# EAGLE design tsr (EAGLE 5.07)
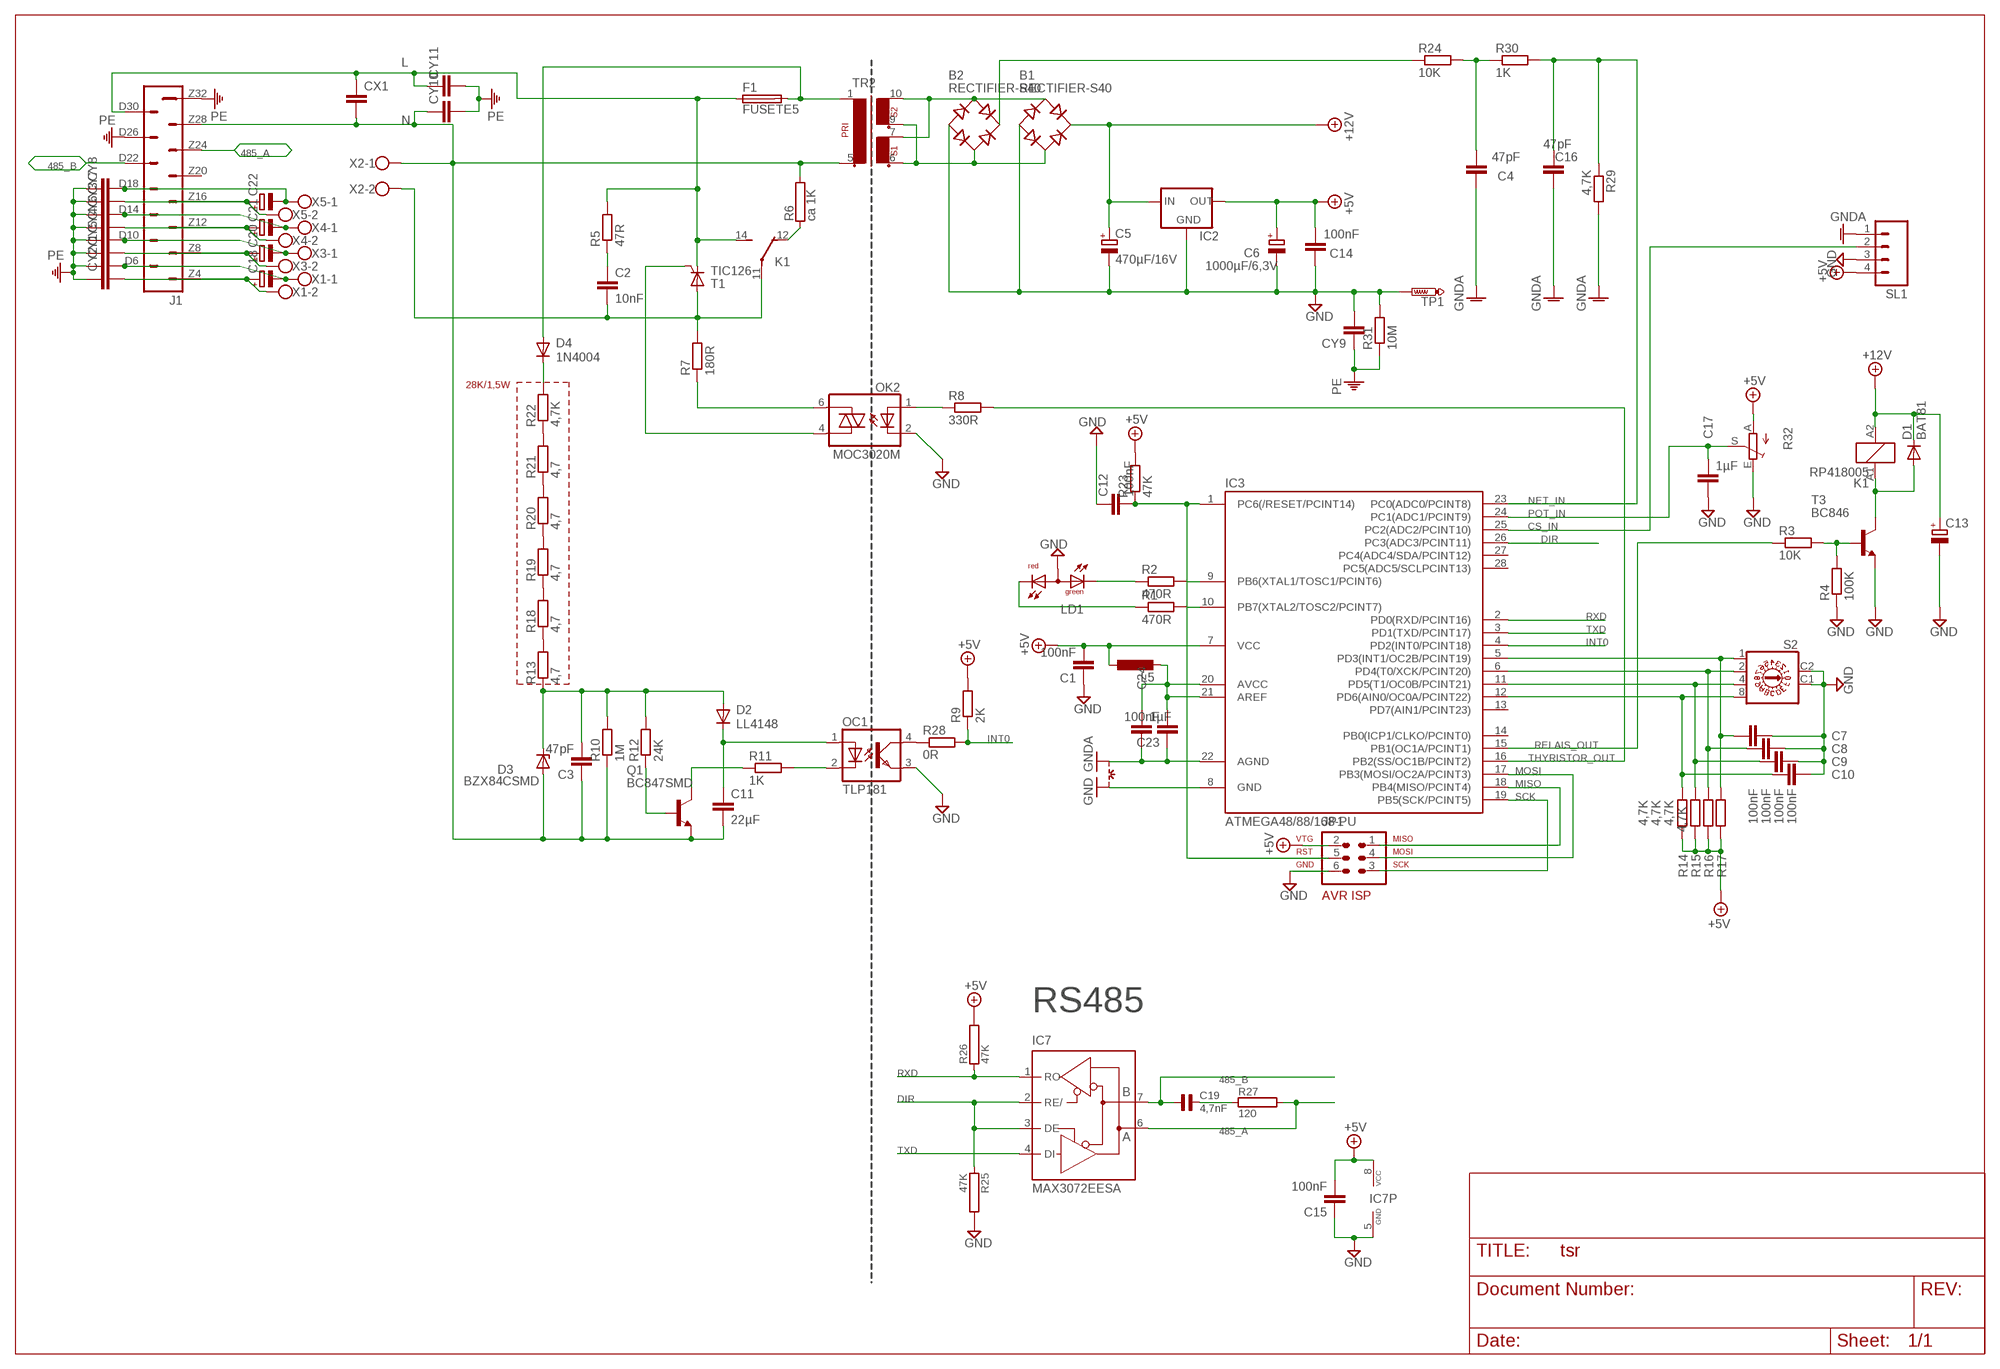
[diagram p0: schematic, sheet 1]

## Parts
B1  RECTIFIER-S40  [TO-269AA]
B2  RECTIFIER-S40  [TO-269AA]
C1  100nF  C-EU025-025X050  [C025-025X050]
C2  10nF  C-EU075-042X103  [C075-042X103]
C3  47pF  C-EUC0805  [C0805]
C4  47pF  C-EUC0805  [C0805]
C5  470µF/16V  CPOL-EUE3.5-8  [E3,5-8]
C6  1000µF/6,3V  CPOL-EUE2.5-7  [E2,5-7]
C7  100nF  C-EUC0805  [C0805]
C8  100nF  C-EUC0805  [C0805]
C9  100nF  C-EUC0805  [C0805]
C10  100nF  C-EUC0805  [C0805]
C11  22µF  C-EUC1206  [C1206]
C12  100nF  C-EUC0805  [C0805]
C13  CPOL-EUE3.5-8  [E3,5-8]
C14  100nF  C-EUC0805  [C0805]
C15  100nF  C-EU025-025X050  [C025-025X050]
C16  47pF  C-EUC0805  [C0805]
C17  1µF  C-EUC0805  [C0805]
C18  CPOL-EUE5-13  [E5-13]
C19  4,7nF  C0805  [C0805]
C20  CPOL-EUE5-13  [E5-13]
C21  CPOL-EUE5-13  [E5-13]
C22  CPOL-EUE5-13  [E5-13]
C23  100nF  C-EUC0805  [C0805]
C24  1µF  C-EUC0805  [C0805]
CX1  CXXC10B5  [XC10B5]
CY1  CYYC10B4  [YC10B4]
CY2  CYYC10B4  [YC10B4]
CY3  CYYC10B4  [YC10B4]
CY4  CYYC10B4  [YC10B4]
CY5  CYYC10B4  [YC10B4]
CY6  CYYC10B4  [YC10B4]
CY7  CYYC10B4  [YC10B4]
CY8  CYYC10B4  [YC10B4]
CY9  CYYC7B5  [YC7B5]
CY10  CYYC10B4  [YC10B4]
CY11  CYYC10B4  [YC10B4]
D1  BAT81  [DO34-7]
D2  LL4148  [MINIMELF]
D3  BZX84CSMD  [TO236]
D4  1N4004  [DO41-10]
F1  FUSETE5  [TE5]
IC2  78XXS  [78XXS]
IC3  ATMEGA48/88/168-PU  [DIL28-3]
IC7  MAX3072EESA  MAX481CSA  [SO08]
J1  H15MLH15ML  [H15ML]
JP1  AVR-ISP-6  [AVR-ISP-6]
K1  RP418005  [RT-C/O12A3.5]
L5  L-EUL2825P  [L2825P]
LD1  DUOLED-RG-A  [DUOLED-A-5MM]
OC1  TLP181  [SO-4]
OK2  MOC3020M  [DIL06]
Q1  BC847SMD  [SOT23]
R1  470R  R-EU_R0805  [R0805]
R2  470R  R-EU_R0805  [R0805]
R3  10K  R-EU_R0805  [R0805]
R4  100K  R-EU_R0805  [R0805]
R5  47R  R-EU_0309/10  [0309/10]
R6  ca 1K  RKH208-8R  [KH208R-8]
R7  180R  R-EU_0207/10  [0207/10@1]
R8  330R  R-EU_R0805  [R0805]
R9  2K  R-EU_R0805  [R0805]
R10  1M  R-EU_R0805  [R0805]
R11  1K  R-EU_R0805  [R0805]
R12  24K  R-EU_R0805  [R0805]
R13  4,7  R-EU_R1206  [R1206]
R14  4,7K  R-EU_R0805  [R0805]
R15  4,7K  R-EU_R0805  [R0805]
R16  4,7K  R-EU_R0805  [R0805]
R17  4,7K  R-EU_R0805  [R0805]
R18  4,7  R-EU_R1206  [R1206]
R19  4,7  R-EU_R1206  [R1206]
R20  4,7  R-EU_R1206  [R1206]
R21  4,7  R-EU_R1206  [R1206]
R22  4,7K  R-EU_R1206  [R1206]
R23  47K  R-EU_R0805  [R0805]
R24  10K  R-EU_0207/15  [0207/15@1]
R25  47K  R0805  [R0805]
R26  47K  R0805  [R0805]
R27  120  R0805  [R0805]
R28  0R  R-EU_0207/10  [0207/10@1]
R29  4,7K  R-EU_R0805  [R0805]
R30  1K  R-EU_R0805  [R0805]
R31  10M  R-EU_0309/12  [0309/12]
R32  TRIM_EU-ECP10P  [ECP10P]
S2  COPAL_HEX  [COPAL_HEX]
SL1  M04  [04P]
T1  TIC126  [TO220CS]
T3  BC846  [SOT23]
TP1  PTR1PAD1-13  [P1-13]
TR2  EI30-2  [EI30-2]
X1  W237-02P  [W237-132]
X2  W237-2N  [W237-2N]
X3  W237-02P  [W237-132]
X4  W237-02P  [W237-132]
X5  W237-02P  [W237-132]
~NUDEV~1  GND-GNDA  [GND-GNDA]

## Nets
485_A: IC7.6(A) J1.Z24 R27.2
485_B: C19.1 IC7.7(B) J1.D22
+5V: C1.2 C6.+ C14.2 C15.2 IC2.OUT IC3.7(VCC) IC7.8(VCC) JP1.2 L5.1 R9.2 R14.1 R15.1 R16.1 R17.1 R23.2 R26.2 R32.A SL1.4
+12V: B1.+ C5.+ C13.+ D1.C IC2.IN K1.A2
/RESET: C12.2 IC3.1(PC6(/RESET/PCINT14)) JP1.5 R23.1
CS_IN: IC3.25(PC2(ADC2/PCINT10)) SL1.2
DIR: IC3.26(PC3(ADC3/PCINT11)) IC7.2(RE/) IC7.3(DE) R25.1
E1: C7.2 IC3.5(PD3(INT1/OC2B/PCINT19)) R17.2 S2.1
E2: C8.2 IC3.6(PD4(T0/XCK/PCINT20)) R16.2 S2.2
E4: C9.2 IC3.11(PD5(T1/OC0B/PCINT21)) R15.2 S2.4
E8: C10.2 IC3.12(PD6(AIN0/OC0A/PCINT22)) R14.2 S2.8
GND: B1.- B2.- C1.1 C5.- C6.- C7.1 C8.1 C9.1 C10.1 C12.1 C13.- C14.1 C15.1 C17.2 CY9.2 IC2.GND IC3.8(GND) IC7.5(GND) JP1.6 LD1.A OC1.3(EMIT) OK2.2(C) R4.1 R25.2 R31.2 R32.E S2.C1 S2.C2 SL1.3 T3.2(E) TP1.TP ~NUDEV~1.GND
GNDA: C4.1 C16.1 C23.1 C24.2 IC3.22(AGND) R29.2 SL1.1 ~NUDEV~1.GNDA
INT0: IC3.4(PD2(INT0/PCINT18)) R9.1 R28.2
L: CX1.1 CY11.1 F1.1 J1.D30 K1.14(2:S) R5.2 T1.C
MISO: IC3.18(PB4(MISO/PCINT4)) JP1.1
MOSI: IC3.17(PB3(MOSI/OC2A/PCINT3)) JP1.4
N: C3.1 C11.2 CX1.2 CY10.1 D3.A J1.Z28 Q1.2(E) R6.2 R10.1 TR2.5 X2.1
N$1: C18.+ CY2.2 J1.Z4 X1.2
N$2: C20.+ CY5.2 J1.Z8 X3.2
N$3: C21.+ CY6.2 J1.Z12 X4.2
N$4: C22.+ CY7.2 J1.Z16 X5.2
N$5: R3.2 R4.2 T3.1(B)
N$6: D1.A K1.A1 T3.3(C)
N$7: K1.12(2:O) R6.1
N$8: C2.2 K1.11(2:P) R7.2 T1.A X2.2
N$9: C2.1 R5.1
N$10: OK2.4(A1) T1.G
N$11: OK2.6(A2) R7.1
N$12: OK2.1(A) R8.1
N$13: C18.- CY1.2 J1.D6 X1.1
N$14: C20.- CY4.2 J1.D10 X3.1
N$15: IC3.9(PB6(XTAL1/TOSC1/PCINT6)) R2.2
N$16: IC3.10(PB7(XTAL2/TOSC2/PCINT7)) R1.2
N$17: LD1.CX(CG) R2.1
N$18: LD1.CR R1.1
N$19: C21.- CY3.2 J1.D14 X4.1
N$21: C22.- CY8.2 J1.D18 X5.1
N$22: B1.AC2 B2.AC2 TR2.6 TR2.9
N$23: R13.2 R18.1
N$24: C3.2 D2.A D3.C R10.2 R12.2 R13.1
N$25: C11.1 D2.C OC1.1(A)
N$26: OC1.2(C) R11.2
N$27: Q1.3(C) R11.1
N$28: Q1.1(B) R12.1
N$29: R18.2 R19.1
N$31: R19.2 R20.1
N$32: R20.2 R21.1
N$33: D4.C R22.2
N$34: R21.2 R22.1
N$35: C4.2 R24.2 R30.1
N$36: C19.2 R27.1
N$37: OC1.4(COL) R28.1
N$38: B1.AC1 B2.AC1 TR2.7 TR2.10
N$39: D4.A F1.2 TR2.1
N$40: B2.+ R24.1
N$50: C23.2 C24.1 IC3.20(AVCC) IC3.21(AREF) L5.2
NET_IN: C16.2 IC3.23(PC0(ADC0/PCINT8)) R29.1 R30.2
PE: CY1.1 CY2.1 CY3.1 CY4.1 CY5.1 CY6.1 CY7.1 CY8.1 CY9.1 CY10.2 CY11.2 J1.D26 J1.Z32 R31.1
POT_IN: C17.1 IC3.24(PC1(ADC1/PCINT9)) R32.S
RELAIS_OUT: IC3.15(PB1(OC1A/PCINT1)) R3.1
RXD: IC3.2(PD0(RXD/PCINT16)) IC7.1(RO) R26.1
SCK: IC3.19(PB5(SCK/PCINT5)) JP1.3
THYRISTOR_OUT: IC3.16(PB2(SS/OC1B/PCINT2)) R8.2
TXD: IC3.3(PD1(TXD/PCINT17)) IC7.4(DI)
Unconnected: IC3.13(PD7(AIN1/PCINT23)) IC3.14(PB0(ICP1/CLKO/PCINT0)) IC3.27(PC4(ADC4/SDA/PCINT12)) IC3.28(PC5(ADC5/SCLPCINT13)) J1.Z20

## Notes on the sheet
- 28K/1,5W
- RS485

## Library data of the parts
B1 B2 = rectifier:RECTIFIER-: Rectifier
C1-C4 C7-C12 C14-C17 C23 C24 = rcl:C-EU: CAPACITOR, European symbol
C5 C6 C13 C18 C20-C22 = rcl:CPOL-EU: POLARIZED CAPACITOR, European symbol
C19 = SMD-Sort2:C0805
CX1 = rcl:CX: X CAPACITOR for power line
CY1-CY11 = rcl:CY: Y CAPACITOR for power line
D1 = diode:BAT81: DIODE barrier diode
D2 = diode-os:LL4148
D3 = diode-1:BZX84CSMD: Z DIODE
D4 = diode-1:1N4004: DIODE general purpose rectifier, 1 A
F1 = fuse:FUSE: Fuse
IC2 = v-reg:78XXS: VOLTAGE REGULATOR
IC3 = atmega8:ATMEGA48/88/168-PU
IC7 = maxim:MAX481CSA: RS485 TRANSEIVER
J1 = 19inch:H15ML
JP1 = atmel:AVR-ISP-6: AVR ISP-6 Serial Programming Header
K1 = relay:RP?18*: Power PCB Relay RP II/1 SCHRACK 1 pole 8 / 12 A Source: http://www.schrack.com/.. 5834.pdf
L5 = rcl:L-EU: INDUCTOR, European symbol
LD1 = led:DUOLED-RG-A: DUO LED 2 colors (red/green), 5 mm, round, common Anode www.ligitek.com or other producers.
OC1 = optocoupler-2:TLP181
OK2 = optocoupler-2:MOC30*M: RANDOM-PHASE OPTOISOLATORS TRIAC DRIVER OUTPUT Source: http://www.fairchildsemi.com MOC3020-M.pdf
Q1 = transistor-npn:BC847*: NPN Transistor
R1-R5 R7-R24 R28-R31 = rcl:R-EU_: RESISTOR, European symbol
R6 = resistor-power:R: Power Resitor
R25-R27 = SMD-Sort2:R0805
R32 = pot:TRIM_EU-: POTENTIOMETER
S2 = switch-dil:COPAL_HEX
SL1 = con-amp-quick:M04: AMP QUICK CONNECTOR
T1 = triac:TIC126: THYRISTOR
T3 = transistor:BC846: NPN TRANSISTOR
TP1 = testpad:PTR1: TEST PIN
TR2 = trafo:EI30-2: TRANSFORMER 1 primary winding, 2 secondary windings ERA
X1 X3-X5 = con-wago-508:W237-02P: WAGO SREW CLAMP
X2 = con-wago-508:W237-2N: WAGO SREW CLAMP
~NUDEV~1 = supply1:GND-GNDA: Example of GND--GNDA NET-Connetor for more info see description in package

## Board
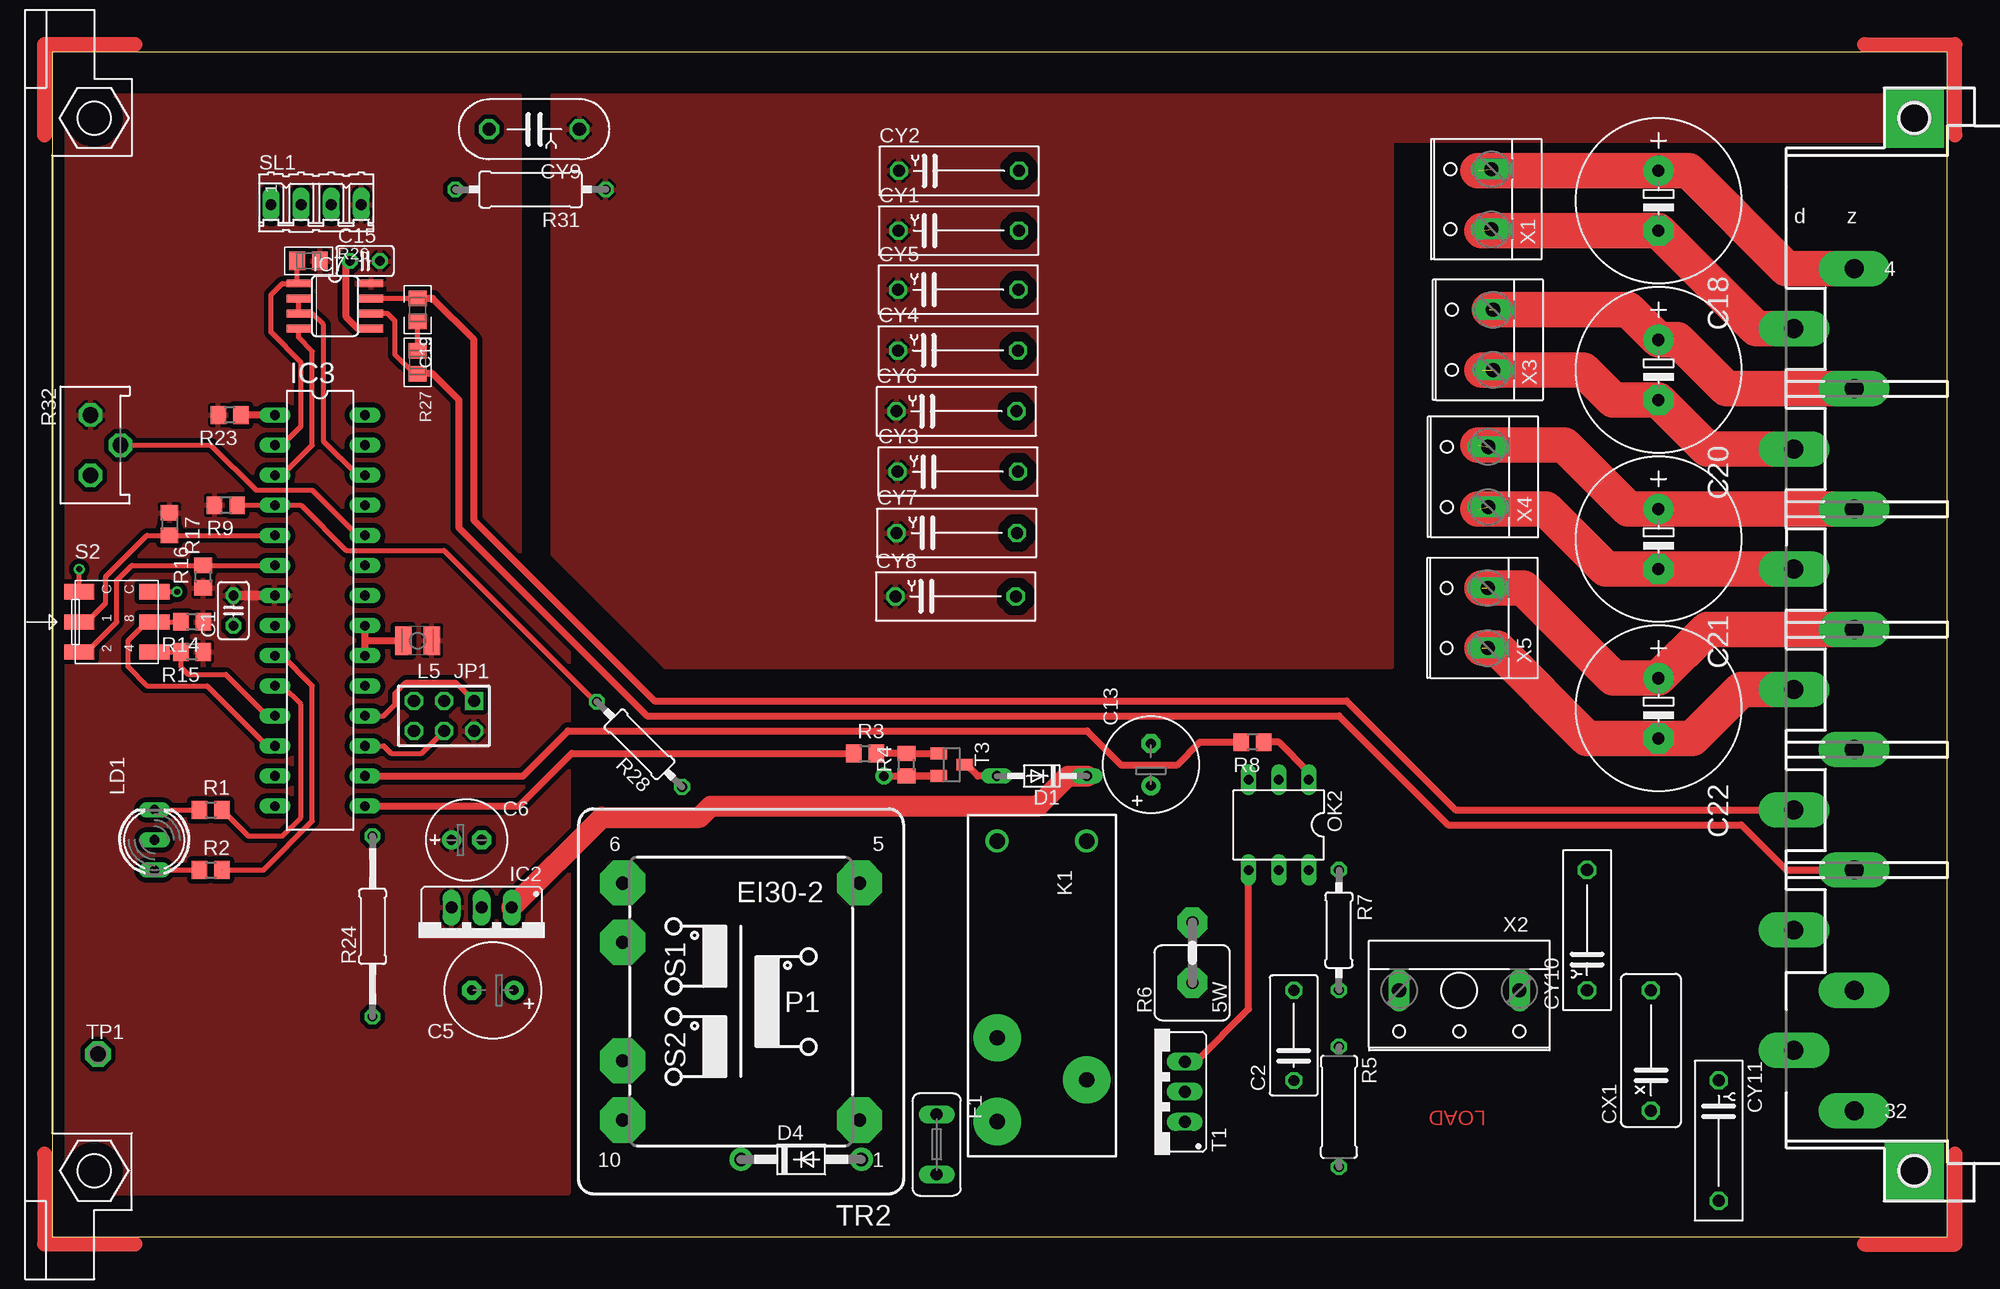
[diagram p1: board, top side]
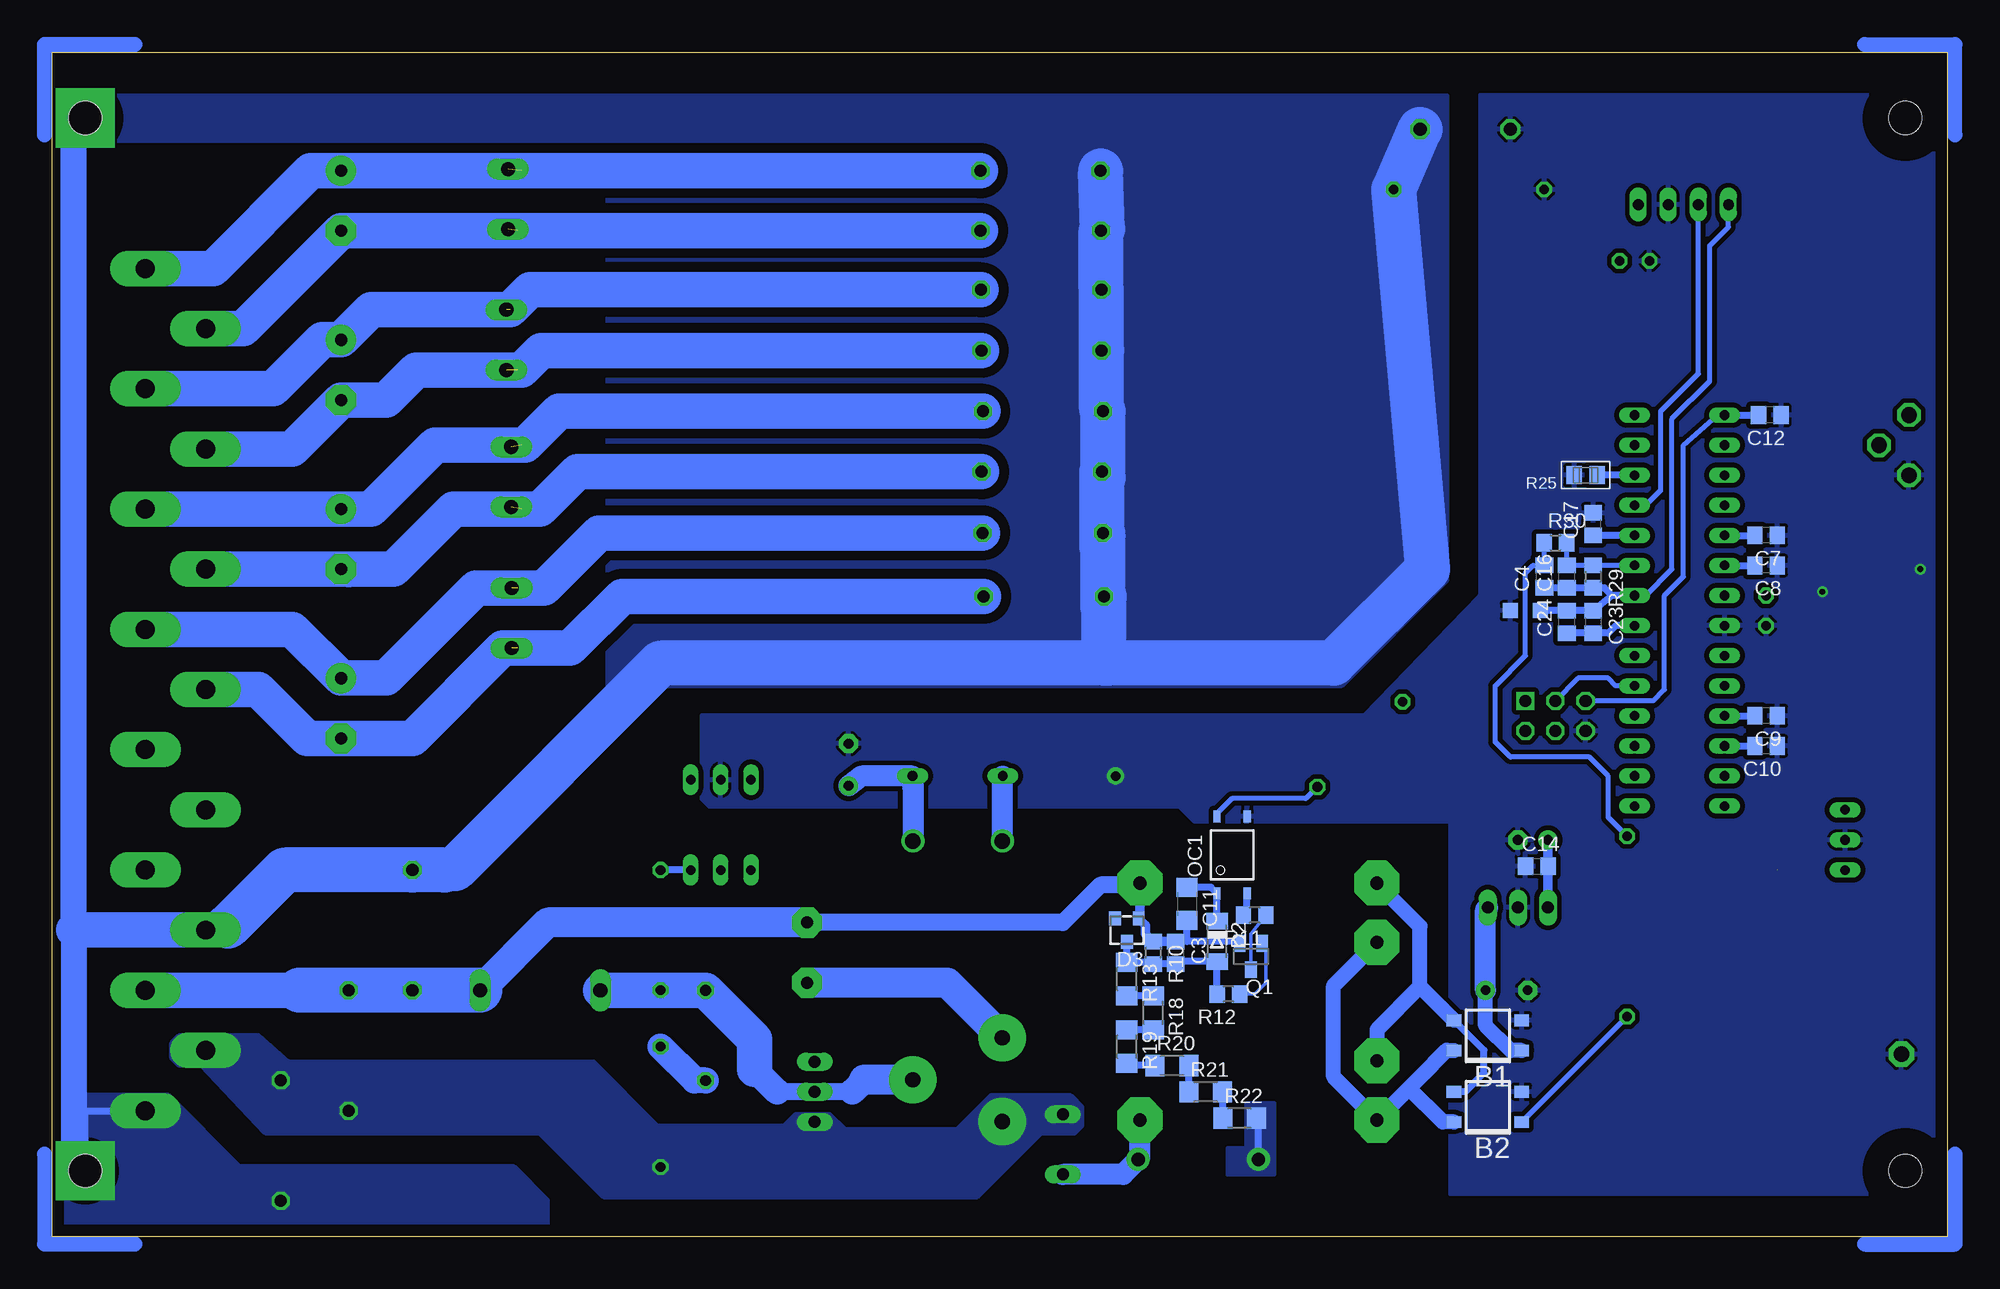
[diagram p2: board, bottom side, seen from below]

Size 160.02 x 100.03 mm. Coordinates in mm from the lower left corner, seen from the top.
Copper layers (1*16): Top 0.035mm / dielectric 1.5mm / Bottom 0.035mm
Design rules "default": minimum track width 10mil, minimum drill 24mil, track to track 8mil, track to pad 8mil, pad to pad 8mil, via to via 8mil, smd to smd 8mil, copper to edge 40mil, drill to drill 8mil, minimum pad ring 10mil, minimum via ring 8mil, stop-mask expansion 4mil, vias tented up to drill 0mil, thermal gap 10mil

### Footprints (pad centres in the part's own frame; a part is rotated, then mirrored left to right if it is on the bottom)
TO-269AA = smd 1 x 1.25: + -1.28,-2.855; - 1.28,-2.855; AC1 -1.28,2.855; AC2 1.28,2.855
C025-025X050 = drill 0.813 octagon: 1 -1.27,0; 2 1.27,0
C075-042X103 = drill 0.914 octagon: 1 -3.81,0; 2 3.81,0
C0805 = smd 1.3 x 1.5: 1 -0.95,0; 2 0.95,0
E3,5-8 = drill 0.813 pad 1.6 round: + -1.778,0 | drill 0.813 pad 1.6 octagon: - 1.778,0
E2,5-7 = drill 0.813 pad 1.6 round: + -1.27,0 | drill 0.813 pad 1.6 octagon: - 1.27,0
C1206 = smd 1.6 x 1.8: 1 -1.4,0; 2 1.4,0
E5-13 = drill 1.016 pad 2.54 round: + -2.54,0 | drill 1.016 pad 2.54 octagon: - 2.54,0
C0805' = smd 1.321 x 1.524: 1 -0.965,0; 2 0.965,0
XC10B5 = drill 1.016 octagon: 1 -5.08,0; 2 5.08,0
YC10B4 = drill 1.016 octagon: 1 -5.08,0; 2 5.08,0
YC7B5 = drill 1.118 octagon: 1 -3.81,0; 2 3.81,0
DO34-7 = drill 0.813 long: A 3.81,0; C -3.81,0
MINIMELF = smd 1.4 x 1.8: A 1.7,0; C -1.7,0
TO236 = smd 1 x 1.2: A -1,-1; C 0,1; NC 1,-1
DO41-10 = drill 1.118 pad 1.93 round: A 5.08,0; C -5.08,0
TE5 = drill 1.016 long: 1 -2.54,0; 2 2.54,0
78XXS = drill 1.016 long: GND 0,-2.54; IN -2.54,-2.54; OUT 2.54,-2.54
DIL28-3 = drill 0.813 long: 1 -16.51,-3.81; 2 -13.97,-3.81; 3 -11.43,-3.81; 4 -8.89,-3.81; 5 -6.35,-3.81; 6 -3.81,-3.81; 7 -1.27,-3.81; 8 1.27,-3.81; 9 3.81,-3.81; 10 6.35,-3.81; 11 8.89,-3.81; 12 11.43,-3.81; 13 13.97,-3.81; 14 16.51,-3.81; 15 16.51,3.81; 16 13.97,3.81; 17 11.43,3.81; 18 8.89,3.81; 19 6.35,3.81; 20 3.81,3.81; 21 1.27,3.81; 22 -1.27,3.81; 23 -3.81,3.81; 24 -6.35,3.81; 25 -8.89,3.81; 26 -11.43,3.81; 27 -13.97,3.81; 28 -16.51,3.81
SO08 = smd 0.66 x 2.032: 1 -1.905,-3.073; 2 -0.635,-3.073; 3 0.635,-3.073; 4 1.905,-3.073; 5 1.905,3.073; 6 0.635,3.073; 7 -0.635,3.073; 8 -1.905,3.073
H15ML = drill 1.6 pad 3 long: D6 147.32,26.67; D10 147.32,16.51; D14 147.32,6.35; D18 147.32,-3.81; D22 147.32,-13.97; D26 147.32,-24.13; D30 147.32,-34.29; Z4 152.4,31.75; Z8 152.4,21.59; Z12 152.4,11.43; Z16 152.4,1.27; Z20 152.4,-8.89; Z24 152.4,-19.05; Z28 152.4,-29.21; Z32 152.4,-39.37 | hole 2.794: 157.48,-44.45; 157.48,44.45; 3.81,44.45; 3.81,-44.45
AVR-ISP-6 = drill 1.016 square: 1 -2.54,-1.27 | drill 1.016 octagon: 2 -2.54,1.27; 3 0,-1.27; 4 0,1.27; 5 2.54,-1.27; 6 2.54,1.27
RT-C/O12A3.5 = drill 1.3 pad 4 round: 11 7.56,3.78; 12 4.02,-3.78; 14 11.1,-3.78 | drill 1.3 round: A1 -12.6,-3.78; A2 -12.6,3.78
L2825P = smd 1.4 x 2.4: 1 -1.2,0; 2 1.2,0
DUOLED-A-5MM = drill 0.813 long: A 0,0; CR 2.54,0; CX -2.54,0
SO-4 = smd 1 x 0.6: 1 -3.24,0.635; 2 -3.24,-1.905; 3 3.24,-1.905; 4 3.24,0.635
DIL06 = drill 0.813 long: 1 -2.54,-3.81; 2 0,-3.81; 3 2.54,-3.81; 4 2.54,3.81; 5 0,3.81; 6 -2.54,3.81
SOT23 = smd 1 x 1.4: 1 -0.95,-1.1; 2 0.95,-1.1; 3 0,1.1
R0805 = smd 1.3 x 1.5: 1 -0.95,0; 2 0.95,0
0309/10 = drill 0.813 octagon: 1 -5.08,0; 2 5.08,0
KH208R-8 = drill 1.016 pad 2.54 octagon: 1 -2.54,0; 2 2.54,0
0207/10@1 = drill 0.813 octagon: 1 -5.08,0; 2 5.08,0
R1206 = smd 1.6 x 1.803: 1 -1.422,0; 2 1.422,0
0207/15@1 = drill 0.813 octagon: 1 -7.62,0; 2 7.62,0
R0805' = smd 1.321 x 1.524: 1 -0.965,0; 2 0.965,0
0309/12 = drill 0.813 octagon: 1 -6.35,0; 2 6.35,0
ECP10P = drill 1.321 octagon: A -2.54,0; E 2.54,0; S 0,2.54
COPAL_HEX = smd 1.27 x 2.54: 1 0,-3.175; 2 2.54,-3.175; 4 2.54,3.175; 8 0,3.175; C1 -2.54,-3.175; C2 -2.54,3.175
04P = drill 0.914 long: 1 -3.81,0; 2 -1.27,0; 3 1.27,0; 4 3.81,0
TO220CS = drill 1.016 long: A 0,-2.54; C -2.54,-2.54; G 2.54,-2.54
P1-13 = drill 1.321 pad 2.159 octagon: TP 0,0
EI30-2 = drill 1.118 pad 3.81 octagon: 1 -10.008,10.008; 5 -10.008,-10.008; 6 10.008,-10.008; 7 10.008,-5.004; 9 10.008,5.004; 10 10.008,10.008
W237-132 = drill 1.194 long: 1 -2.54,-0.635; 2 2.54,-0.635
W237-2N = drill 1.194 long: 1 -5.08,-0.635; 2 5.08,-0.635
GND-GNDA = smd 1.27 x 1.27: GND -1.27,0; GNDA 1.27,0

### Placement (x,y rotation side)
B1  38.8,16.99 90 bottom
B2  38.8,10.96 90 bottom
C1  15.3,52.87 90 top
C2  104.84,16.99 90 top
C3  65.15,23.98 270 bottom
C4  34.04,55.73 90 bottom
C5  37.21,20.8 180 top
C6  34.99,33.5 0 top
C7  15.3,59.22 180 bottom
C8  15.3,56.68 180 bottom
C9  15.3,43.98 180 bottom
C10  15.3,41.44 180 bottom
C11  64.2,28.11 270 bottom
C12  14.99,69.38 180 bottom
C13  92.77,39.85 90 top
C14  34.67,31.28 0 bottom
C15  26.42,82.4 0 top
C16  32.13,55.73 90 bottom
C17  29.91,60.17 90 bottom
C18  135.64,87.48 270 top
C19  4,7nF  [C0805']  30.86,78.27 270 top
C20  135.64,73.19 270 top
C21  135.64,58.9 270 top
C22  135.64,44.62 270 top
C23  29.91,51.92 270 bottom
C24  32.13,51.92 90 bottom
CX1  135,15.72 90 top
CY1  76.54,84.95 0 top
CY2  76.57,90 0 top
CY3  76.47,64.6 0 top
CY4  76.49,74.83 0 top
CY5  76.51,79.97 0 top
CY6  76.36,69.7 0 top
CY7  76.38,59.43 0 top
CY8  76.28,54.07 0 top
CY9  40.7,93.51 180 top
CY10  129.6,25.88 90 top
CY11  140.72,8.1 270 top
D1  83.57,38.9 180 top
D2  61.66,24.93 270 bottom
D3  69.28,25.88 180 bottom
D4  63.25,6.52 0 top
F1  74.68,7.79 270 top
IC2  36.26,25.25 180 top
IC3  22.61,52.87 270 top
IC7  23.88,78.59 270 top
J1  -0.25,50.01 0 top
JP1  33.08,43.98 180 top
K1  83.57,20.8 270 top
L5  30.86,50.33 180 top
LD1  8.64,33.5 90 top
OC1  61.02,32.23 90 bottom
OK2  103.57,34.77 180 top
Q1  58.8,23.66 180 bottom
R1  13.4,36.04 0 top
R2  13.4,30.96 0 top
R3  68.64,40.81 0 top
R4  72.14,39.85 90 top
R5  108.65,10.96 270 top
R6  96.27,23.98 90 top
R7  108.65,25.88 270 top
R8  101.35,41.76 180 top
R9  14.67,61.76 180 top
R10  67.06,23.98 270 bottom
R11  58.48,27.15 180 bottom
R12  60.71,20.49 180 bottom
R13  69.28,21.76 270 bottom
R14  11.81,51.92 180 top
R15  11.81,49.38 180 top
R16  12.76,55.73 90 top
R17  9.91,60.17 270 top
R18  67.06,18.9 270 bottom
R19  69.28,16.04 270 bottom
R20  65.47,14.45 0 bottom
R21  62.61,12.23 0 bottom
R22  59.75,10.01 0 bottom
R23  14.99,69.38 180 top
R24  27.05,26.2 90 top
R25  47K  [R0805']  30.54,64.3 180 bottom
R26  47K  [R0805']  21.65,82.4 0 top
R27  120  [R0805']  30.86,73.83 270 top
R28  49.59,41.57 135 top
R29  29.91,55.73 270 bottom
R30  33.08,58.59 0 bottom
R31  40.39,88.43 180 top
R32  3.24,66.84 270 top
S2  5.46,51.92 270 top
SL1  22.29,87.16 0 top
T1  93.09,12.23 90 top
T3  75.95,39.85 270 top
TP1  3.87,15.41 0 top
TR2  58.17,19.85 180 top
X1  120.9,87.61 90 top
X2  118.81,20.17 180 top
X3  121.03,75.73 90 top
X4  120.62,64.15 90 top
X5  120.58,52.23 90 top
~NUDEV~1  35.62,52.87 0 bottom

### Tracks (layer width: path | path; a pad name or v marks a point on that pad's centre or on a via)
485_A
  Top 0.406: R27.2 30.56,72.86 28.96,74.46 28.96,77.32 28.32,77.95 IC7.6
  Top 0.61: J1.Z24 146.43,30.96 142.62,34.77 117.86,34.77 108.65,43.98 50.23,43.98 34.35,59.86 34.35,70.65 32.13,72.87 30.87,72.87 R27.2
485_B
  Top 0.406: IC7.7 30.85,79.22 C19.1
  Top 0.61: J1.D22 118.49,36.04 109.28,45.25 50.86,45.25 35.62,60.49 35.62,75.73 32.13,79.22 30.87,79.22 C19.1
+5V
  Top 0.813: C1.2 IC3.7
  Bottom 0.813: C6.+ IC2.OUT C14.2
  pour Top (isolate 0.406): 0.7,96.37 39.43,96.37 39.43,54.14 43.56,50.01 43.56,3.66 0.7,3.66
+12V
  Top 1.778: D1.C 85.79,38.9 83.25,36.36 55.63,36.36 54.67,35.41 46.42,35.41 IC2.IN
  Bottom 1.27: C5.+ 38.99,17.82 36.89,15.72 B1.+
  Bottom 1.778: K1.A2 87.35,37.92 D1.C 91.69,38.9 C13.+ | C5.+ 38.99,27.6 IC2.IN
/RESET
  Top 0.61: IC3.1 R23.1
  Bottom 0.406: JP1.5 24.83,45.25 23.88,46.2 23.88,54.14 22.29,55.73 22.29,66.84 19.43,69.38 IC3.1
  Bottom 0.61: IC3.1 R23.1
CS_IN
  Bottom 0.406: SL1.2 21.02,72.87 24.19,69.7 24.19,63.03 25.46,61.76 IC3.25
DIR
  Top 0.406: IC7.2 IC7.3 21.97,77.95 22.92,77 22.92,67.16 25.78,64.3 IC3.26
  Bottom 0.61: IC3.26 R25.1
E1
  Top 0.406: S2.1 2.92,51.92 4.51,53.51 4.51,55.73 8,59.22 R17.2 IC3.5
  Bottom 0.61: IC3.5 C7.2
E2
  Top 0.406: S2.2 2.92,49.38 5.46,51.92 5.46,55.41 6.73,56.68 R16.2 IC3.6
  Bottom 0.61: IC3.6 C8.2
E4
  Top 0.406: S2.4 R15.2 10.86,48.11 11.49,47.47 14.67,47.47 18.16,43.98 IC3.11
  Bottom 0.61: IC3.11 C9.2
E8
  Top 0.406: IC3.12 18.16,41.44 13.08,46.52 8,46.52 6.41,48.11 6.41,50.33 8,51.92 S2.8 R14.2
  Bottom 0.61: IC3.12 C10.2
GND  (via drill 0.5, 0.8 pad 1.42)
  Top 0.406: S2.C1 v2.29,56.36 | S2.C2 v10.54,54.46
  Top 0.61: C15.1 24.83,82.08 24.83,77.64 25.78,76.68 IC7.5 | 74.36,38.9 R4.1 | 74.36,38.9 T3.2 | v70.23,38.9 74.36,38.9
  pour Bottom (isolate 0.406): 0.7,96.37 39.43,96.37 39.43,54.14 49.28,43.98 105.16,43.98 105.16,37 104.52,36.36 64.83,36.36 63.56,35.09 41.97,35.09 41.97,3.66 0.7,3.66
GNDA
  Bottom 0.406: SL1.1 18.48,85.26 20.07,83.67 20.07,72.24 23.24,69.06 23.24,56.36 25.46,54.14 IC3.22
  Bottom 0.61: IC3.22 28.32,54.14 | 28.32,54.14 C23.1 C24.2 34.04,52.87 ~NUDEV~1.GNDA | 28.32,54.14 28.96,54.78 R29.2 C16.1 C4.1
INT0
  Top 0.406: R9.1 IC3.4 21.02,61.76 24.83,57.95 33.08,57.95 45.37,45.67 R28.2
L
  pour Bottom (isolate 0.406, no thermals): 149.29,16.99 142.62,16.99 140.08,14.77 114.36,14.77 108.97,9.37 98.17,9.37 97.22,10.33 94.36,10.33 93.09,9.06 83.57,9.06 80.71,11.91 74.04,11.91 73.09,10.96 73.09,9.37 73.72,8.74 76.58,8.74 81.98,3.34 113.41,3.34 118.81,8.74 141.99,8.74 147.38,14.45 149.29,14.45 149.92,15.09 149.92,16.36
MISO
  Top 0.406: JP1.1 34.04,46.84 29.91,46.84 28.96,45.89 28.96,44.93 28,43.98 IC3.18
MOSI
  Top 0.406: IC3.17 28,41.44 28.64,40.81 31.18,40.81 JP1.4
N
  Bottom 0.61: D3.A 68.17,26.99 | R10.1 | C3.1 64.2,24.93 | 64.2,24.93 C11.2 | 64.2,24.93 | Q1.2 59.75,24.93 64.2,24.93
  Bottom 0.813: 68.17,26.99 TR2.5 | D3.A 67.69,26.3 67.69,25.57 R10.1 | C3.1 R10.1
  Bottom 1.016: 68.34,29.69 68.01,29.69 TR2.5
  Bottom 1.422: R6.2 74.68,26.52 71.5,29.69 68.34,29.69 TR2.5
  Bottom 2.54: R6.2 118.17,26.52 X2.1
  Bottom 3: 139.13,20.8 J1.Z28
  Bottom 3.81: X2.1 CY10.1 CX1.2 139.13,20.8
N$1  (1 unrouted)
  Top 3: J1.Z4 146.43,81.76 138.18,90.02 120.4,90.02
  Bottom 3: J1.Z4 146.43,81.76 138.18,90.02 C18.+ 81.66,90.02 CY2.2
N$2  (1 unrouted)
  Top 3: J1.Z8 141.35,71.6 137.22,75.73 C20.+ 133.1,78.27 121.35,78.27
  Bottom 3: J1.Z8 141.35,71.6 137.22,75.73 C20.+ 133.1,78.27 121.35,78.27 119.65,79.97 CY5.2
N$3  (1 unrouted)
  Top 3: J1.Z12 133.1,61.44 127.7,66.84 120.4,66.84
  Bottom 3: C21.+ J1.Z12 | C21.+ | CY6.2 117.22,69.7 120.08,66.84 127.7,66.84 133.1,61.44 C21.+
N$4  (1 unrouted)
  Top 3: J1.Z16 139.76,51.28 C22.+ 131.83,47.16 124.21,54.78 120.71,54.78
  Bottom 3: J1.Z16 139.76,51.28 C22.+ 131.83,47.16 124.21,54.78 118.49,54.78 113.84,59.43 CY7.2
N$5
  Top 0.61: R3.2 R4.2 T3.1
N$6
  Top 0.61: D1.A 78.17,38.9 77.53,39.54 77.22,39.68 T3.3
  Bottom 1.778: K1.A1 79.79,37.92 D1.A
N$7
  Bottom 2.54: K1.12 84.44,21.44 R6.1
N$8
  Bottom 1.422: 92.46,12.23 T1.A 98.81,12.23
  Bottom 2.184: 91.5,13.18 92.46,12.23 | 98.81,12.23 100.71,14.14
  Bottom 2.54: K1.11 91.44,13.24 91.5,13.18
  Bottom 3: X2.2 R7.2 C2.2 100.71,16.68 100.71,14.14
N$9
  Bottom 2.184: C2.1 105.79,13.18 R5.1
N$10
  Top 0.61: T1.G 96.58,14.77 101.03,19.22 OK2.4
N$11
  Bottom 0.61: OK2.6 R7.1
N$12
  Top 0.61: OK2.1 106.11,39.22 103.57,41.76 R8.1
N$13  (1 unrouted)
  Top 3: J1.D6 143.89,76.68 C18.- 120.71,84.94
  Bottom 3: C18.- 143.89,76.68 J1.D6 | C18.- 135.51,84.81 | CY1.2 135.62,84.95 C18.-
N$14  (1 unrouted)
  Top 3: J1.D10 139.76,66.52 C20.- 131.83,70.65 129.29,73.19 120.71,73.19
  Bottom 3: J1.D10 139.76,66.52 C20.- | C20.- 135.59,70.61 | CY4.2 118.75,74.83 120.4,73.19 129.29,73.19 131.83,70.65 C20.-
N$15  (1 unrouted)
  Top 0.406: R2.2 17.84,30.96 21.97,35.09 21.97,46.52 19.43,49.06 IC3.9
N$16
  Top 0.406: R1.2 16.57,33.82 19.43,33.82 21.02,35.41 21.02,44.93 19.43,46.52 IC3.10
N$17
  Top 0.406: LD1.CX R2.1
N$18
  Top 0.406: LD1.CR R1.1
N$19  (1 unrouted)
  Top 3: J1.D14 131.19,56.36 126.11,61.44 120.4,61.44
  Bottom 3: C21.- J1.D14 | C21.- 135,56.36 134.97,56.33 | CY3.2 115.65,64.6 118.81,61.44 126.11,61.44 131.19,56.36 C21.-
N$21  (1 unrouted)
  Top 3: J1.D18 142.62,46.2 138.49,42.08 129.6,42.08 121.98,49.7 120.71,49.7
  Bottom 3: J1.D18 142.62,46.2 138.49,42.08 C22.- 129.6,42.08 121.98,49.7 116.27,49.7 111.9,54.07 CY8.2
N$22
  Bottom 0.61: B2.AC2 40.69,12.24 39.12,13.82 39.12,15.74 B1.AC2
  Bottom 1.27: TR2.6 44.51,26.2 44.51,21.12 | 44.51,21.12 44.52,21.12 B1.AC2 | TR2.9 48.16,17.48 44.51,21.12
N$23
  Bottom 0.61: R18.1 67.07,20.33 R13.2
N$24
  Bottom 0.61: D3.C R13.1 67.21,23.18 R10.2 C3.2 64.95,23.23 D2.A R12.2
N$25
  Bottom 0.61: D2.C OC1.1 62.17,29.51 C11.1
N$26
  Bottom 0.61: 59.12,27.47 R11.2 59.12,27.47 OC1.2
N$27
  Bottom 0.305: Q1.3 58.8,25.57 R11.1
N$28
  Bottom 0.305: Q1.1 57.7,24.76 57.53,24.93 57.53,21.44 58.48,20.49 R12.1
N$29
  Bottom 0.61: R18.2 67.07,17.46 R19.1
N$31
  Bottom 0.61: R19.2 69.28,14.45 R20.1
N$32
  Bottom 0.61: R20.2 64.03,14.44 R21.1
N$33
  Bottom 0.61: D4.C 58.17,9.84 R22.2
  pour Bottom (isolate 0.406, no thermals): 59.12,11.28 56.9,11.28 56.9,5.25 60.71,5.25 60.71,7.47 59.12,7.47
N$34
  Bottom 0.61: R21.2 61.18,12.22 R22.1
N$35
  Bottom 0.406: C4.2 R30.1 | C4.2 | C4.2 34.99,56.68 35.62,56.05 35.62,49.06 38.16,46.52 38.16,41.76 36.89,40.49 30.23,40.49 28.64,38.9 28.64,35.41 R24.2
N$36
  Top 0.406: R27.1 C19.2
N$37
  Bottom 0.406: R28.1 54.17,37 60.39,37 61.66,35.73 OC1.4
N$38
  Bottom 1.27: 45.46,12.54 44.5,13.5 42.29,15.73 B1.AC1 | 45.46,12.54 TR2.10 51.82,13.5 51.82,21.2 TR2.7 | B2.AC1 42.6,9.68 45.46,12.54
N$39
  Bottom 1.778: F1.2 69.6,5.25 D4.A 68.17,6.67 TR2.1
N$40
  Bottom 0.406: B2.+ R24.1
N$50
  Top 0.61: IC3.21 IC3.20 26.42,50.33 L5.2
  Bottom 0.61: IC3.21 28,51.6 28.64,50.97 C23.2 C24.1
NET_IN
  Bottom 0.406: IC3.23 R29.1 C16.2 32.13,58.9 R30.2
PE  (via drill 2.5 pad 5)
  Bottom 0.61: J1.Z32 157.23,10.64 v157.23,5.56
  Bottom 1.778: 126.9,30.96 126.75,30.96 126.01,31.06
  Bottom 2.184: 145.16,26.2 J1.D26 | v157.23,94.46 158.18,93.51 158.18,25.88 158.18,6.52 v157.23,5.56
  Bottom 3: J1.D26 158.18,25.88
  Bottom 3.81: 70.87,48.43 51.82,48.43 43.88,56.36 R31.1 CY9.1 | 70.87,48.43 108.65,48.43 126.01,31.06 | 126.9,30.96 CY10.2 140.4,30.96 145.16,26.2 | CY2.1 71.33,85.08 CY1.1 71.46,80.01 CY5.1 71.43,74.85 CY4.1 71.41,69.83 CY6.1 71.28,64.08 CY3.1 71.39,58.25 CY7.1 71.3,53.21 CY8.1 71.2,48.41 70.87,48.43
  pour Bottom (isolate 0.406, no thermals): 150.24,11.91 159.77,11.91 159.77,0.17 118.17,0.17 118.17,3.02 121.03,5.88 144.21,5.88
  pour Bottom (isolate 0.813): 42.29,96.37 42.29,55.41 51.18,46.52 113.09,46.52 113.09,92.56 159.45,92.56 159.45,96.37
  pour Top (isolate 0.813): 42.29,96.37 159.45,96.37 159.45,92.56 113.09,92.56 113.09,48.11 51.82,48.11 42.29,57.63
POT_IN
  Top 0.406: R32.S 13.4,66.84 17.21,63.03 21.97,63.03 25.78,59.22 IC3.24
  Bottom 0.61: IC3.24 C17.1
RELAIS_OUT
  Top 0.61: R3.1 43.88,40.81 39.43,36.36 IC3.15
RXD
  Top 0.406: R26.1 20.69,80.61 IC7.1 19.43,80.49 18.48,79.54 18.48,76.37 21.02,73.83 21.02,68.43 19.43,66.84 IC3.2
SCK
  Bottom 0.406: IC3.19 28,46.52 28.64,47.16 31.18,47.16 JP1.3
THYRISTOR_OUT
  Top 0.61: IC3.16 39.75,38.9 43.56,42.71 87.38,42.71 90.23,39.85 95,39.85 96.9,41.76 R8.2
TXD
  Top 0.406: IC3.3 19.43,64.3 21.97,66.84 21.97,74.78 20.8,75.95 IC7.4

### Text on the board
Top: LOAD